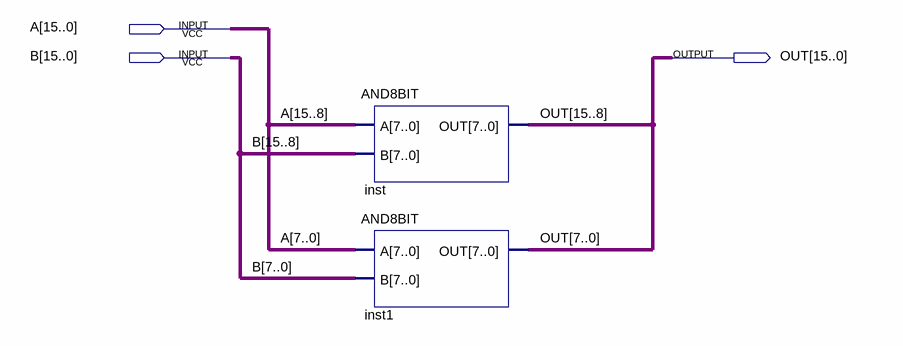
[diagram p0: schematic sheet]
// Quartus schematic AND16BIT.bdf as structural Verilog: 2 symbols, 3 pins
module AND16BIT (
  input  [15:0] A,
  input  [15:0] B,
  output [15:0] OUT
);

  AND8BIT inst (.A(A[15:8]), .B(B[15:8]), .OUT(OUT[15:8]));
  AND8BIT inst1 (.A(A[7:0]), .B(B[7:0]), .OUT(OUT[7:0]));
endmodule
